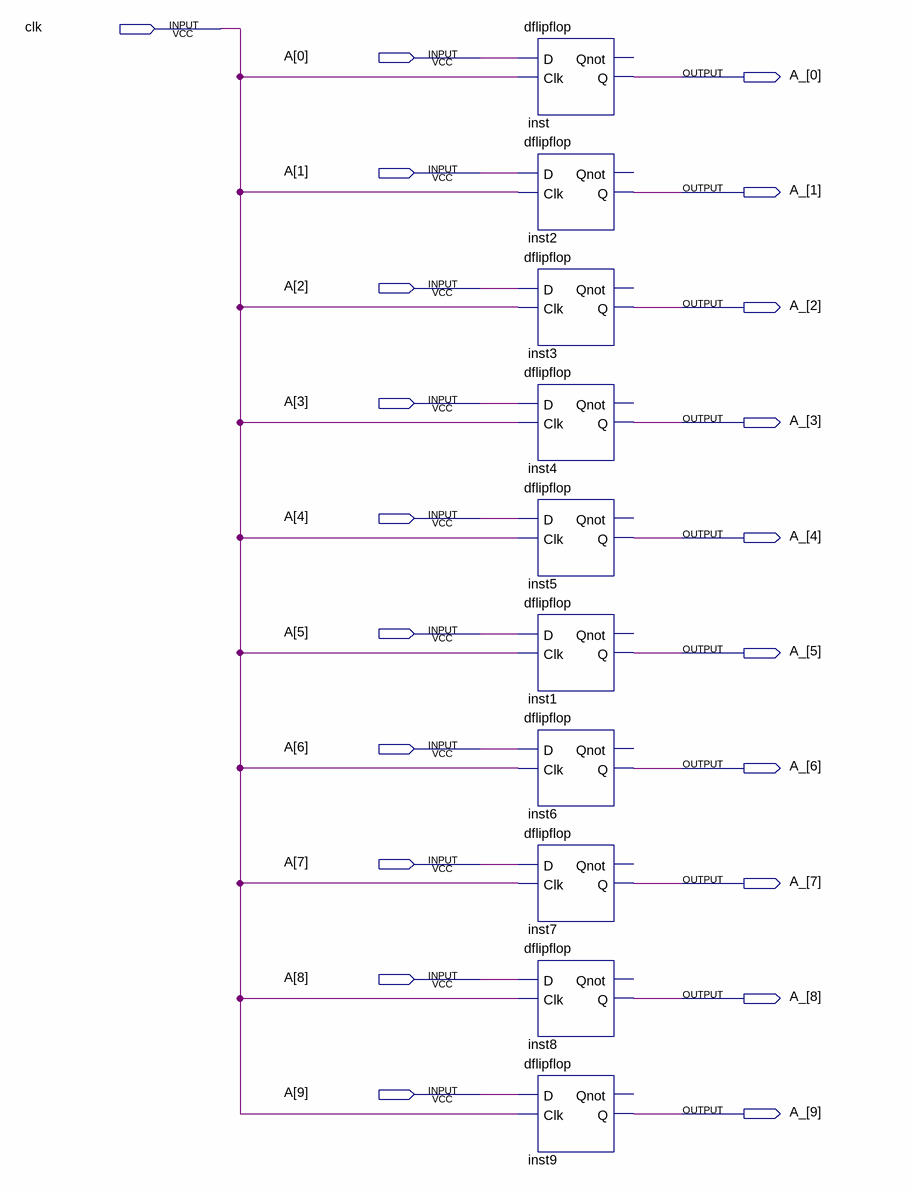
[diagram p0: schematic sheet]
// Quartus schematic 10bitregister.bdf as structural Verilog: 10 symbols, 21 pins
module \10bitregister  (
  input  clk,
  input  [9:0] A,
  output [9:0] A_
);

  dflipflop inst (.D(A[0]), .Clk(clk), .Q(A_[0]));  // open: Qnot
  dflipflop inst2 (.D(A[1]), .Clk(clk), .Q(A_[1]));  // open: Qnot
  dflipflop inst3 (.D(A[2]), .Clk(clk), .Q(A_[2]));  // open: Qnot
  dflipflop inst4 (.D(A[3]), .Clk(clk), .Q(A_[3]));  // open: Qnot
  dflipflop inst5 (.D(A[4]), .Clk(clk), .Q(A_[4]));  // open: Qnot
  dflipflop inst1 (.D(A[5]), .Clk(clk), .Q(A_[5]));  // open: Qnot
  dflipflop inst6 (.D(A[6]), .Clk(clk), .Q(A_[6]));  // open: Qnot
  dflipflop inst7 (.D(A[7]), .Clk(clk), .Q(A_[7]));  // open: Qnot
  dflipflop inst8 (.D(A[8]), .Clk(clk), .Q(A_[8]));  // open: Qnot
  dflipflop inst9 (.D(A[9]), .Clk(clk), .Q(A_[9]));  // open: Qnot
endmodule
